# EAGLE board InkTime (EAGLE 9.7.0)
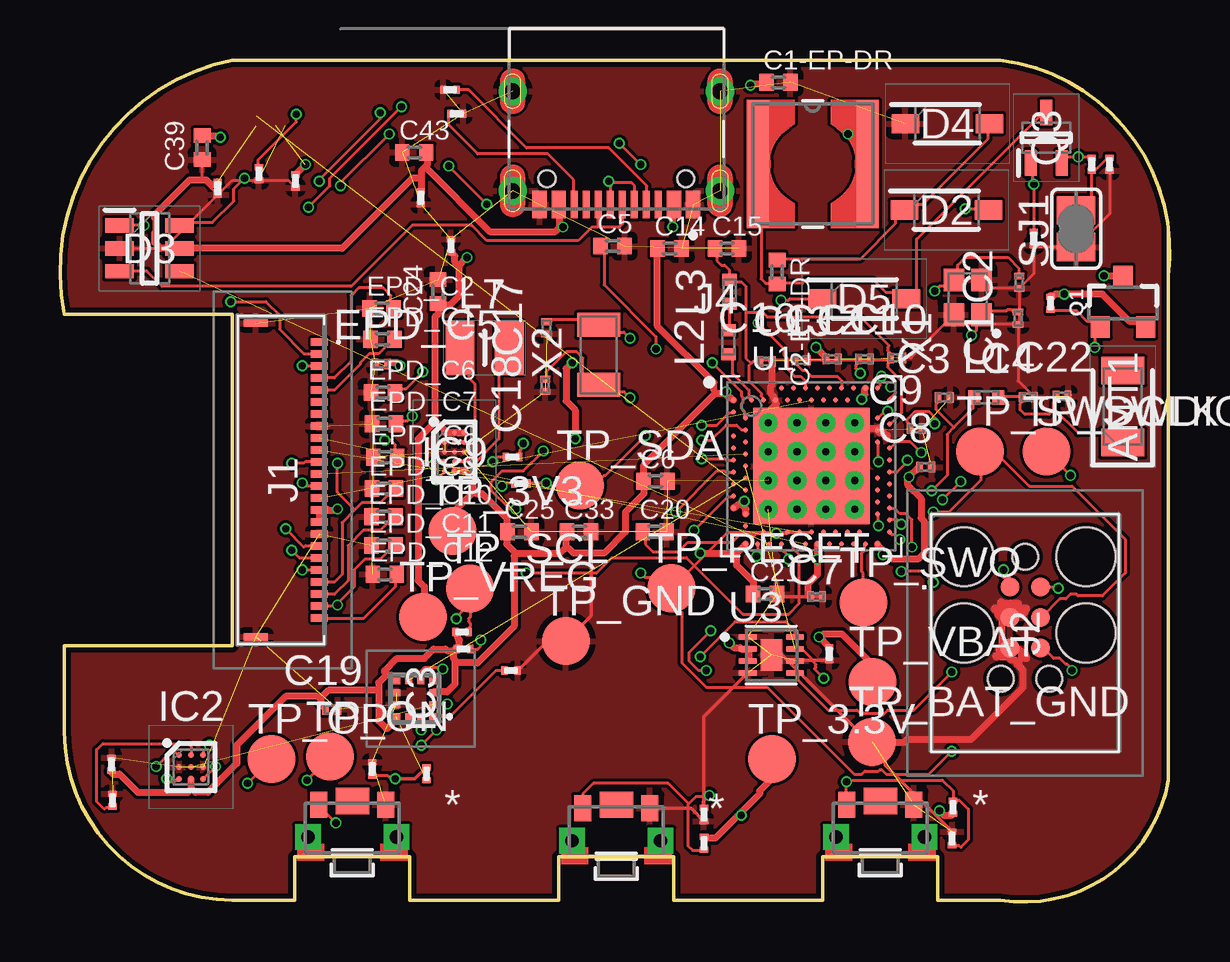
[diagram p2: board, top side]
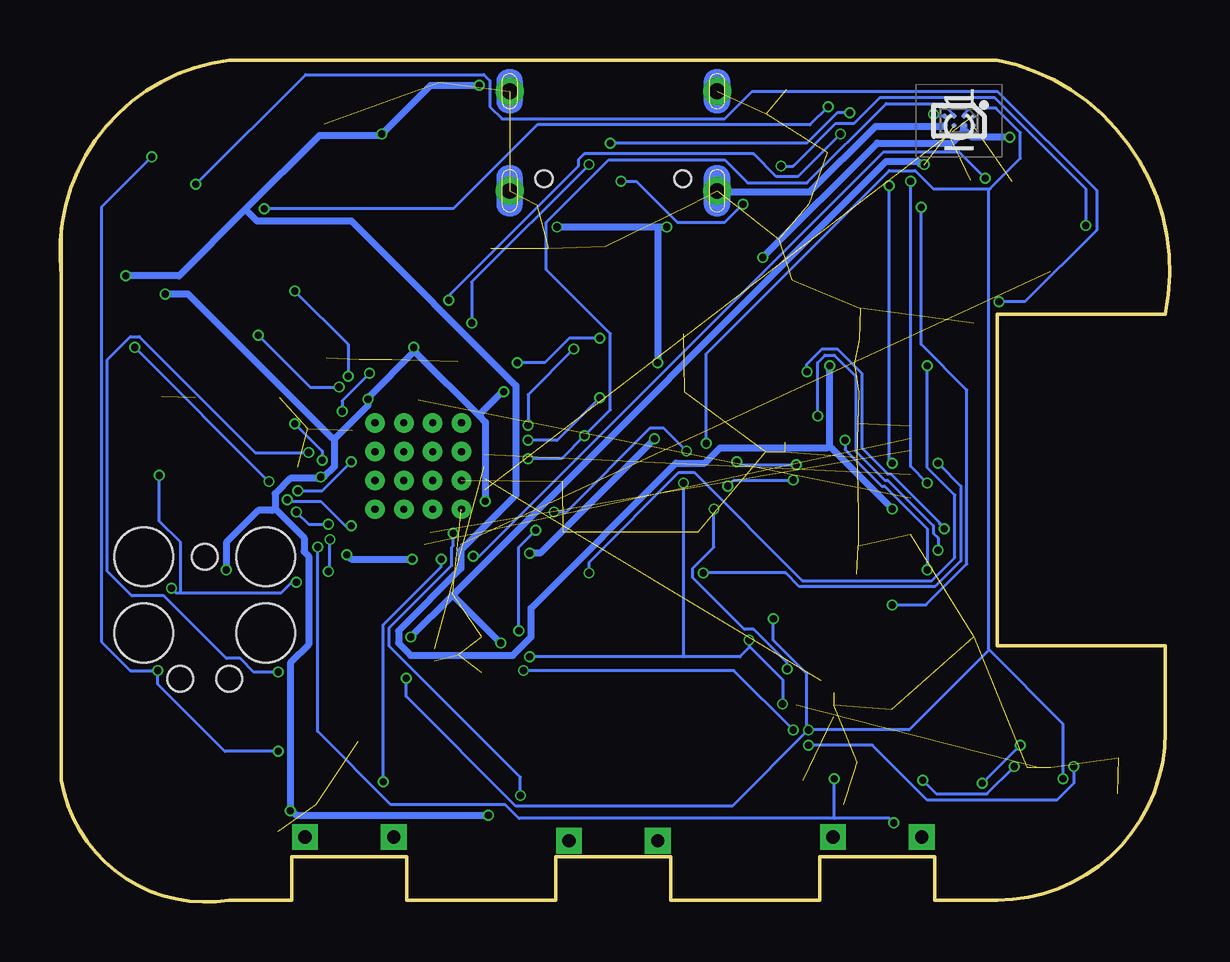
[diagram p3: board, bottom side, seen from below]

Size 46.24 x 35.08 mm. Coordinates in mm from the lower left corner, seen from the top.
Outline: 46.18,26.08 46.18,5.08 arc-90 39.18,0.08 36.58,0.08 36.58,1.88 31.78,1.88 31.78,0.08 25.58,0.08 25.58,1.88 20.78,1.88 20.78,0.08 14.58,0.08 14.58,1.88 9.78,1.88 9.78,0.08 7.18,0.08 arc-90 0.18,7.08 0.18,10.68 7.18,10.68 7.18,24.48 0.18,24.48 arc-90 7.18,35.08 39.18,35.08 arc-90 46.18,26.08
Outline: 46.18,26.08 46.18,28.08
Copper layers (1+2*15+16): Top 0.035mm / dielectric 1.6mm / Route2 0.035mm / dielectric 0.15mm / Route15 0.035mm / dielectric 0.2mm / Bottom 0.035mm
Design rules "jlcpcb-2layers.dru *": minimum track width 5mil, minimum drill 0.3mm, track to track 5mil, track to pad 5mil, pad to pad 5mil, via to via 5mil, smd to smd 5mil, copper to edge 0.2mm, drill to drill 6mil, minimum pad ring 10mil, minimum via ring 3mil, stop-mask expansion 4mil, vias tented up to drill 0mil, thermal gap 10mil
Net classes: 1 Power: width 0.3 mm

## Footprints (pad centres in the part's own frame; a part is rotated, then mirrored left to right if it is on the bottom)
2450AT18B100E_ANTC3216X140N = smd 1.15 x 1.8: 1 -1.5,0; 2 1.5,0
NORDIC_NRF_3_RESC0201_L = smd 0.28 x 0.43: 1 -0.255,0; 2 0.255,0
PERFECT_0402_0402 = smd 0.6 x 0.7: 1 -0.5,0; 2 0.5,0
GRM011R60J152KE01L_1_0201 = smd 0.35 x 0.25: 1 0,0.275; 2 0,-0.275
ESP32_C6_LIBRARY_5_SOD3716X135N = smd 1.15 x 0.8: 1 -1.75,0; 2 1.75,0
ESP32_C6_LIBRARY_3_SOT95P280X145-6N = smd 1.2 x 0.6: 1 -1.25,0.95; 2 -1.25,0; 3 -1.25,-0.95; 4 1.25,-0.95; 5 1.25,0; 6 1.25,0.95
BQ25180YBGR_BGA8C40P2X4_100X155X50 = smd 0.2 x 0.2: A1 -0.2,0.6; A2 0.2,0.6; B1 -0.2,0.2; B2 0.2,0.2; C1 -0.2,-0.2; C2 0.2,-0.2; D1 -0.2,-0.6; D2 0.2,-0.6
DRV2605YZFR_BGA9C50P3X3_144X144X62 = smd 0.25 x 0.25: A1 -0.5,0.5; A2 0,0.5; A3 0.5,0.5; B1 -0.5,0; B2 0,0; B3 0.5,0; C1 -0.5,-0.5; C2 0,-0.5; C3 0.5,-0.5
BMA423_BMA423 = smd 0.3 x 0.35: 1 -0.75,-0.775; 2 -0.25,-0.775; 3 0.25,-0.775; 4 0.75,-0.775; 7 0.75,0.775; 8 0.25,0.775; 9 -0.25,0.775; 10 -0.75,0.775 | smd 0.35 x 0.3: 5 0.775,-0.25; 6 0.775,0.25; 11 -0.775,0.25; 12 -0.775,-0.25
RT6160AWSC_BGA15C40P3X5_140X230X60 = smd 0.216 x 0.216: A1 -0.4,0.8; A2 0,0.8; A3 0.4,0.8; B1 -0.4,0.4; B2 0,0.4; B3 0.4,0.4; C1 -0.4,0; C2 0,0; C3 0.4,0; D1 -0.4,-0.4; D2 0,-0.4; D3 0.4,-0.4; E1 -0.4,-0.8; E2 0,-0.8; E3 0.4,-0.8
503480-2400_5034802400 = smd 0.3 x 0.7: 1 -5.75,1.525; 2 -5.25,1.525; 3 -4.75,1.525; 4 -4.25,1.525; 5 -3.75,1.525; 6 -3.25,1.525; 7 -2.75,1.525; 8 -2.25,1.525; 9 -1.75,1.525; 10 -1.25,1.525; 11 -0.75,1.525; 12 -0.25,1.525; 13 0.25,1.525; 14 0.75,1.525; 15 1.25,1.525; 16 1.75,1.525; 17 2.25,1.525; 18 2.75,1.525; 19 3.25,1.525; 20 3.75,1.525; 21 4.25,1.525; 22 4.75,1.525; 23 5.25,1.525; 24 5.75,1.525 | smd 0.3 x 1: MP1 -6.54,-1.125; MP2 6.54,-1.125
TC2030-IDC_TC2030IDC = smd 0.783 x 0.783: 1 -0.953,-0.635; 2 -0.953,0.635; 3 0.317,-0.635; 4 0.317,0.635; 5 1.588,-0.635; 6 1.588,0.635 | hole 2.451: -2.223,-2.54; -2.223,2.54; 0.952,-2.54; 0.952,2.54 | hole 1.067: -2.223,0; 2.857,-1.016; 2.857,1.016
KH-TYPE-C-16P_KINGHELM_KH-TYPE-C-16P = smd 0.6 x 1.15: A1_B12 -3.2,4.725; A4_B9 -2.4,4.725; A9_B4 2.4,4.725; A12_B1 3.2,4.725 | smd 0.3 x 1.15: A5 -1.25,4.725; A6 -0.25,4.725; A7 0.25,4.725; A8 1.25,4.725; B5 1.75,4.725; B6 0.75,4.725; B7 -0.75,4.725; B8 -1.75,4.725 | drill 0.65 pad 1.05: SH1 -4.32,0; SH2 4.32,0; SH3 -4.32,4.15; SH4 4.32,4.15 | hole 0.7: -2.89,3.65; 2.89,3.65
NORDIC_NRF_2_RESC0402_L = smd 0.5 x 0.6: 1 -0.5,0; 2 0.5,0
ESP32_C6_LIBRARY_2_IND_4828-WE-TPC_WRE = smd 0.9 x 5.3: 1 -2.286,0; 2 2.286,0
MLP2016SR47MT0S1_INDC2016X100N = smd 1.2 x 2.2: 1 -1.028,0; 2 1.028,0
ESP32_C6_LIBRARY_4_ESP32_C6_LIBRARY_4_ESP32_C6_LIBRARY_4_ESP32_C6_LIBRARY_4_ESP32_WROVER_SPARKFUN-DISCRETESEMI_SOT23-3 = smd 0.8 x 0.9: 1 -0.95,-1; 2 0.95,-1; 3 0,1.1
ESP32_C6_LIBRARY_6_SOT65P210X110-3N = smd 1.05 x 0.5: 1 -1.05,0.65; 2 -1.05,-0.65; 3 1.05,0
ERA-1AEB3401C_0201 = smd 0.35 x 0.25: 1 0,0.275; 2 0,-0.275
ESP32_C6_LIBRARY_7_JUMPER_SJ = smd 1.168 x 1.6: 1 -0.762,0; 2 0.762,0
2025-10-22_07-23-44_LIBRARY_SW_EVP-AKE31A_PAN = smd 0.711 x 1.092: 1 -1.4,-0.972; 2 1.4,-0.972 | drill 0.559 pad 0.914 square: 3 -1.848,0.381; 4 1.848,0.381 | smd 1.397 x 1.092: 5 0,-1.124
HECTOR_WATCH_1_TP20R = smd 2 x 2: TP 0,0
NORDIC_NRF_4_AQFN50P700X700X85_HS-74N = smd 4.85 x 4.85: P$74 0,0 | drill 0.3 pad 0.6: P$75 -1.8,1.8; P$76 -0.6,1.8; P$77 0.6,1.8; P$78 1.8,1.8; P$79 -1.8,0.6; P$80 -0.6,0.6; P$81 0.6,0.6; P$82 1.8,0.6; P$83 -1.8,-0.6; P$84 -0.6,-0.6; P$85 0.6,-0.6; P$86 1.8,-0.6; P$87 -1.8,-1.8; P$88 -0.6,-1.8; P$89 0.6,-1.8; P$90 1.8,-1.8 | smd 0.2 x 0.2: P$A8 -1.25,3.25; P$A10 -0.75,3.25; P$A12 -0.25,3.25; P$A14 0.25,3.25; P$A16 0.75,3.25; P$A18 1.25,3.25; P$A20 1.75,3.25; P$A22 2.25,3.25; P$A23 2.75,3.25; P$AA24 3.25,-2.25; P$AB2 -2.75,-2.5; P$AC5 -2,-2.75; P$AC9 -1,-2.75; P$AC11 -0.5,-2.75; P$AC13 0,-2.75; P$AC15 0.5,-2.75; P$AC17 1,-2.75; P$AC19 1.5,-2.75; P$AC21 2,-2.75; P$AC24 3.25,-2.75; P$AD2 -2.75,-3.25; P$AD4 -2.25,-3.25; P$AD6 -1.75,-3.25; P$AD8 -1.25,-3.25; P$AD10 -0.75,-3.25; P$AD12 -0.25,-3.25; P$AD14 0.25,-3.25; P$AD16 0.75,-3.25; P$AD18 1.25,-3.25; P$AD20 1.75,-3.25; P$AD22 2.25,-3.25; P$AD23 2.75,-3.25; P$B1 -3.25,2.75; P$B3 -2.5,2.75; P$B5 -2,2.75; P$B7 -1.5,2.75; P$B9 -1,2.75; P$B11 -0.5,2.75; P$B13 0,2.75; P$B15 0.5,2.75; P$B17 1,2.75; P$B19 1.5,2.75; P$B24 3.25,2.75; P$C1 -3.25,2.25; P$D2 -2.75,2; P$D23 2.75,2; P$E24 3.25,1.75; P$F2 -2.75,1.5; P$F23 2.75,1.5; P$G1 -3.25,1.25; P$H2 -2.75,1; P$H23 2.75,1; P$J1 -3.25,0.75; P$J24 3.25,0.75; P$K2 -2.75,0.5; P$L1 -3.25,0.25; P$L24 3.25,0.25; P$M2 -2.75,0; P$N1 -3.25,-0.25; P$N24 3.25,-0.25; P$P2 -2.75,-0.5; P$P23 2.75,-0.5; P$R1 -3.25,-0.75; P$R24 3.25,-0.75; P$T2 -2.75,-1; P$T23 2.75,-1; P$U1 -3.25,-1.25; P$U24 3.25,-1.25; P$V23 2.75,-1.5; P$W1 -3.25,-1.75; P$W24 3.25,-1.75; P$Y2 -2.75,-2; P$Y23 2.75,-2
ESP32_C6_LIBRARY_SON50P200X200X80-9N = smd 0.76 x 0.27: 1 -0.985,0.75; 2 -0.985,0.25; 3 -0.985,-0.25; 4 -0.985,-0.75; 5 0.985,-0.75; 6 0.985,-0.25; 7 0.985,0.25; 8 0.985,0.75 | smd 0.9 x 1.3: 9 0,0
NORDIC_NRF_BT-XTAL_2016_N = smd 0.95 x 0.85: 1 -0.725,-0.575; 2 0.725,-0.575; 3 0.725,0.575; 4 -0.725,0.575
NORDIC_NRF_1_XTAL_3215_N = smd 1 x 1.8: 1 -1.25,0; 2 1.25,0

## Placement (x,y rotation side)
ANT1  2450AT18B100E  [2450AT18B100E_ANTC3216X140N]  44.28,20.64 90 top
C1  12pF  [NORDIC_NRF_3_RESC0201_L]  39.92,24.32 90 top
C1-EP-DR  10uF  [PERFECT_0402_0402]  29.93,34.15 0 top
C2  12pF  [NORDIC_NRF_3_RESC0201_L]  39.97,25.82 90 top
C2-EP-DR  4.7uF/25V  [PERFECT_0402_0402]  29.88,26.25 270 top
C3  1pF  [NORDIC_NRF_3_RESC0201_L]  36.84,21.02 0 top
C4  1pF  [NORDIC_NRF_3_RESC0201_L]  40.35,21.03 0 top
C5  100nF  [PERFECT_0402_0402]  23.02,27.33 0 top
C6  4.7uF  [PERFECT_0402_0402]  24.81,17.53 0 top
C7  100nF  [NORDIC_NRF_3_RESC0201_L]  31.52,12.72 0 top
C8  100nF  [NORDIC_NRF_3_RESC0201_L]  36.07,18.12 0 top
C9  820pF  [NORDIC_NRF_3_RESC0201_L]  35.67,19.72 0 top
C10  N.C.  [NORDIC_NRF_3_RESC0201_L]  34.86,22.67 0 top
C11  100pF  [NORDIC_NRF_3_RESC0201_L]  33.52,22.62 0 top
C12  100nF  [NORDIC_NRF_3_RESC0201_L]  32.17,22.62 0 top
C13  N.C.  [NORDIC_NRF_3_RESC0201_L]  30.88,22.57 0 top
C14  4.7uF  [PERFECT_0402_0402]  25.4,27.23 0 top
C15  1.0uF  [PERFECT_0402_0402]  27.79,27.23 0 top
C16  47nF  [NORDIC_NRF_3_RESC0201_L]  29.42,22.52 0 top
C17  12pF  [NORDIC_NRF_3_RESC0201_L]  20.27,23.92 90 top
C18  12pF  [NORDIC_NRF_3_RESC0201_L]  20.22,21.52 90 top
C19  100nF  [NORDIC_NRF_3_RESC0201_L]  11.32,8.02 0 top
C20  4.7uF  [PERFECT_0402_0402]  24.78,15.43 0 top
C21  4.7uF  [PERFECT_0402_0402]  29.37,12.83 0 top
C22  N.C.  [NORDIC_NRF_3_RESC0201_L]  41.75,21.08 0 top
C23  0.1uF  [GRM011R60J152KE01L_1_0201]  16.29,27.34 0 top
C24  10uF  [PERFECT_0402_0402]  15.75,25.43 270 top
C25  22uF  [PERFECT_0402_0402]  19.14,15.43 0 top
C27  0.1uF  [GRM011R60J152KE01L_1_0201]  32.05,10.34 180 top
C29  1uF  [GRM011R60J152KE01L_1_0201]  13.01,5.54 0 top
C30  1uF  [GRM011R60J152KE01L_1_0201]  37.17,2.64 0 top
C31  1uF  [GRM011R60J152KE01L_1_0201]  26.83,3.64 180 top
C32  1uF  [GRM011R60J152KE01L_1_0201]  2.19,4.24 0 top
C33  22uF  [PERFECT_0402_0402]  21.63,15.43 0 top
C34  0.1uF  [GRM011R60J152KE01L_1_0201]  2.15,5.74 0 top
C37  1uF  [GRM011R60J152KE01L_1_0201]  9.81,30.04 180 top
C38  1uF  [GRM011R60J152KE01L_1_0201]  6.57,29.74 180 top
C39  10uF  [PERFECT_0402_0402]  5.92,31.43 270 top
C42  0.1uF  [GRM011R60J152KE01L_1_0201]  15.03,29.34 0 top
C43  4.7uF  [PERFECT_0402_0402]  14.76,31.23 0 top
D2  MBR0530  [ESP32_C6_LIBRARY_5_SOD3716X135N]  36.93,28.83 0 top
D3  USBLC6-2SC6Y  [ESP32_C6_LIBRARY_3_SOT95P280X145-6N]  3.73,27.23 0 top
D4  MBR0530  [ESP32_C6_LIBRARY_5_SOD3716X135N]  36.97,32.43 0 top
D5  MBR0530  [ESP32_C6_LIBRARY_5_SOD3716X135N]  33.51,25.13 0 top
EPD_C1  1uF/50V  [PERFECT_0402_0402]  13.43,23.45 0 top
EPD_C2  1uF/50V  [PERFECT_0402_0402]  13.4,24.73 0 top
EPD_C5  0.1uF/50V  [NORDIC_NRF_3_RESC0201_L]  13.39,22.42 0 top
EPD_C6  1uF/50V  [PERFECT_0402_0402]  13.45,21.23 0 top
EPD_C7  1uF/50V  [PERFECT_0402_0402]  13.5,19.93 0 top
EPD_C8  1uF/50V  [PERFECT_0402_0402]  13.55,18.53 0 top
EPD_C9  1uF/50V  [PERFECT_0402_0402]  13.5,17.23 0 top
EPD_C10  1uF/50V  [PERFECT_0402_0402]  13.48,16.05 0 top
EPD_C11  1uF/50V  [PERFECT_0402_0402]  13.48,14.85 0 top
EPD_C12  1uF/50V  [PERFECT_0402_0402]  13.53,13.65 0 top
IC1  BQ25180YBGR  [BQ25180YBGR_BGA8C40P2X4_100X155X50]  8.78,32.55 270 bottom
IC2  DRV2605YZFR  [DRV2605YZFR_BGA9C50P3X3_144X144X62]  5.46,5.62 0 top
IC3  BMA421  [BMA423_BMA423]  14.78,8.47 90 top
IC9  RT6160AWSC  [RT6160AWSC_BGA15C40P3X5_140X230X60]  16.43,18.75 0 top
J1  503480-2400  [503480-2400_5034802400]  9.28,17.58 270 top
J2  TC2030-IDC  [TC2030-IDC_TC2030IDC]  40.21,12.16 270 top
J4  KH-TYPE-C-16P  [KH-TYPE-C-16P_KINGHELM_KH-TYPE-C-16P]  23.18,33.78 180 top
L1  3.9nH  [NORDIC_NRF_2_RESC0402_L]  38.6,21.02 0 top
L2  10uH  [NORDIC_NRF_2_RESC0402_L]  27.85,23.32 90 top
L3  15nH  [NORDIC_NRF_2_RESC0402_L]  27.9,25.42 90 top
L5  68uH  [ESP32_C6_LIBRARY_2_IND_4828-WE-TPC_WRE]  31.36,30.75 0 top
L7  FTC252012SR47MBCA  [MLP2016SR47MT0S1_INDC2016X100N]  17.69,23.09 0 top
Q1  20V/4.2A/52mΩ/1.4W  [ESP32_C6_LIBRARY_4_ESP32_C6_LIBRARY_4_ESP32_C6_LIBRARY_4_ESP32_C6_LIBRARY_4_ESP32_WROVER_SPARKFUN-DISCRETESEMI_SOT23-3]  44.29,24.96 0 top
Q3  SI1308EDL-T1-GE3  [ESP32_C6_LIBRARY_6_SOT65P210X110-3N]  41.09,31.84 90 top
R1_EP_DR  0.47  [ERA-1AEB3401C_0201]  42.99,30.74 180 top
R1_USB  5K1  [ERA-1AEB3401C_0201]  16.25,33.84 90 top
R2  0  [ERA-1AEB3401C_0201]  19.21,17.44 270 top
R2_EP_DR  10K  [ERA-1AEB3401C_0201]  40.57,27.64 180 top
R2_USB  5K1  [ERA-1AEB3401C_0201]  16.53,32.84 90 top
R3  0  [ERA-1AEB3401C_0201]  18.79,9.64 270 top
R4  0  [ERA-1AEB3401C_0201]  18.85,18.54 270 top
R5  10K  [ERA-1AEB3401C_0201]  37.21,3.94 0 top
R7  10K  [ERA-1AEB3401C_0201]  15.27,5.34 0 top
R8  10K  [ERA-1AEB3401C_0201]  26.83,2.44 180 top
R9  10K  [ERA-1AEB3401C_0201]  8.29,30.34 180 top
R17  3K3  [ERA-1AEB3401C_0201]  16.75,11.24 90 top
R18  3K3  [ERA-1AEB3401C_0201]  16.81,10.54 90 top
R_PWR_EPD  10K  [ERA-1AEB3401C_0201]  41.27,24.94 180 top
R_TYPE_SEL  2.2  [ERA-1AEB3401C_0201]  43.73,30.74 180 top
SJ1  [ESP32_C6_LIBRARY_7_JUMPER_SJ]  42.34,28.05 90 top
SW_DN  2025-10-22_07-23-44_LIBRARY_EVP-AKE31ASW_EVP-AKE31A_PAN  [2025-10-22_07-23-44_LIBRARY_SW_EVP-AKE31A_PAN]  12.18,3.08 180 top
SW_ENT  2025-10-22_07-23-44_LIBRARY_EVP-AKE31ASW_EVP-AKE31A_PAN  [2025-10-22_07-23-44_LIBRARY_SW_EVP-AKE31A_PAN]  23.18,2.93 180 top
SW_UP  2025-10-22_07-23-44_LIBRARY_EVP-AKE31ASW_EVP-AKE31A_PAN  [2025-10-22_07-23-44_LIBRARY_SW_EVP-AKE31A_PAN]  34.18,3.08 180 top
TP_3.3V  HECTOR_WATCH_1_TPTP20R  [HECTOR_WATCH_1_TP20R]  29.66,5.95 0 top
TP_3V3  HECTOR_WATCH_1_TPTP20R  [HECTOR_WATCH_1_TP20R]  16.36,15.45 0 top
TP_BAT_GND  HECTOR_WATCH_1_TPTP20R  [HECTOR_WATCH_1_TP20R]  33.84,6.67 0 top
TP_GND  HECTOR_WATCH_1_TPTP20R  [HECTOR_WATCH_1_TP20R]  21.08,10.87 0 top
TP_ON  HECTOR_WATCH_1_TPTP20R  [HECTOR_WATCH_1_TP20R]  11.24,6.05 0 top
TP_OP  HECTOR_WATCH_1_TPTP20R  [HECTOR_WATCH_1_TP20R]  8.82,5.95 0 top
TP_RESET  HECTOR_WATCH_1_TPTP20R  [HECTOR_WATCH_1_TP20R]  25.48,13.07 0 top
TP_SCL  HECTOR_WATCH_1_TPTP20R  [HECTOR_WATCH_1_TP20R]  17.08,13.05 0 top
TP_SDA  HECTOR_WATCH_1_TPTP20R  [HECTOR_WATCH_1_TP20R]  21.67,17.35 0 top
TP_SWDCLK  HECTOR_WATCH_1_TPTP20R  [HECTOR_WATCH_1_TP20R]  38.34,18.77 0 top
TP_SWDIO  HECTOR_WATCH_1_TPTP20R  [HECTOR_WATCH_1_TP20R]  41.11,18.77 0 top
TP_SWO  HECTOR_WATCH_1_TPTP20R  [HECTOR_WATCH_1_TP20R]  33.47,12.47 0 top
TP_VBAT  HECTOR_WATCH_1_TPTP20R  [HECTOR_WATCH_1_TP20R]  33.86,9.17 0 top
TP_VREG  HECTOR_WATCH_1_TPTP20R  [HECTOR_WATCH_1_TP20R]  15.12,11.87 0 top
U1  NRF52840_QF  [NORDIC_NRF_4_AQFN50P700X700X85_HS-74N]  31.31,18.16 0 top
U3  MAX17048G+T10  [ESP32_C6_LIBRARY_SON50P200X200X80-9N]  29.64,10.29 0 top
X1  32MHz  [NORDIC_NRF_BT-XTAL_2016_N]  37.82,25.19 90 top
X2  32.768kHZ  [NORDIC_NRF_1_XTAL_3215_N]  22.45,22.79 270 top

## Tracks (layer width: path | path; a pad name or v marks a point on that pad's centre or on a via)
3V3  (via drill 0.3)  (1 unrouted)
  Top 0.3: 28.32,3.68 29.15,4.5 29.15,4.63 29.66,5.14 29.66,5.9 TP_3.3V.TP | 28.32,3.68 27.31,2.66 26.86,2.66 R8.2 | R_PWR_EPD.2 41.28,25.27 41.4,25.27 41.47,25.33 v41.85,25.33 43.44,25.33 44.58,24.19 45.02,24.19 45.22,23.99 Q1.2 | U1.P$AD14 31.56,14.85 v31.56,14.28 31.56,13.64 31.18,13.26 31.18,12.76 31.25,12.69 C7.1 | 28.39,16.57 28.26,16.57 28.13,16.44 28.07,16.44 U1.P$W1 | 28.39,16.57 28.58,16.38 28.58,16.18 U1.P$Y2 | 34.39,14.57 34.67,14.28 35.75,14.28 36.01,14.53 36.01,15.87 35.88,15.99 35.88,16.82 35.31,17.39 35.31,17.65 v35.37,17.71 35.75,18.09 C8.1 | 34.39,14.57 34.1,14.85 U1.P$AD23 | v33.4,20.95 33.4,21.01 33.53,21.14 33.53,21.39 U1.P$A22 | v36.64,3.8 36.83,3.61 37.15,3.61 R5.2 | v31.5,23.11 31.88,22.73 31.88,22.66 C12.1 | v28.51,16.69 28.51,16.63 28.39,16.57 | v39.31,13.83 39.31,13.64 39.56,13.39 39.56,13.14 J2.1 | v34.29,14.47 34.39,14.57 | v28.39,3.61 28.32,3.68 | 5.46,4.69 5.46,5.07 IC2.C2 | 5.46,4.69 5.34,4.56 3.24,4.56 2.48,5.33 2.23,5.33 2.1,5.45 C34.2 | 16.45,9.96 16.45,10.09 16.39,10.15 16.39,10.47 | 16.45,9.96 16.45,9.07 16.13,8.76 15.56,8.76 IC3.3 | 16.39,10.47 16.51,10.6 R18.1 16.64,10.66 16.64,10.91 16.58,10.98 16.58,11.17 16.51,11.23 R17.1 | 13.27,8.82 13.27,9.14 13.59,9.45 | 13.27,8.82 13.27,7.55 13.59,7.23 13.66,7.23 14.04,7.61 14.04,7.68 IC3.10 | 13.59,9.45 13.78,9.45 13.97,9.26 IC3.7 | 10.86,8.5 10.86,8.25 11.05,8.06 C19.1 | 10.86,8.5 11.18,8.82 13.27,8.82 | 16.39,10.47 16.13,10.47 16.07,10.53 15.56,10.53 15.18,10.15 14.04,10.15 13.53,9.64 13.53,9.58 13.59,9.45 | 5.46,4.69 5.59,4.63 5.65,4.56 6.16,4.56 7.37,5.77 7.37,6.53 9.4,8.56 10.73,8.56 10.86,8.5
  Top 0.3: 16.83,17.96 16.45,17.96 IC9.E2 | 16.83,17.96 IC9.E3 | 17.21,17.07 17.21,17.65 16.96,17.9 16.83,17.96 | 17.21,17.07 16.39,16.25 16.39,15.49 TP_3V3.TP | 17.21,17.07 17.34,17.01 17.59,17.01 18.61,15.99 18.61,15.49 C25.1 18.61,15.3 18.61,14.91 18.99,14.53 | 21.09,14.79 21.09,15.42 C33.1 | 21.09,14.79 20.83,14.53 18.99,14.53 | 27.69,21.2 27.88,21.01 27.94,21.01 28.01,20.95 U1.P$B1 | 27.31,21.2 27.69,21.2 | 27.31,21.2 24.32,18.22 24.32,17.58 C6.1 24.39,17.45 24.39,17.39 24.32,17.33 24.32,17.01 23.56,16.25 23.56,15.42 22.67,14.53 21.4,14.53 21.21,14.72 21.09,14.79 | C14.1 24.89,27.17 24.89,23.99 27.24,21.65 27.24,21.33 27.31,21.2 | 16.45,9.96 17.4,9.96 18.93,11.49 18.93,14.41 18.99,14.53 | v27.75,21.26 27.69,21.2
  Bottom 0.3: 34.8,19.3 33.4,20.69 v33.4,20.95 33.34,21.07 31.5,22.92 | 34.8,19.3 34.8,18.15 35.25,17.71 v35.37,17.71 35.5,17.65 36.64,17.65 37.28,17.01 37.28,16.38 | 37.28,16.38 36.07,15.17 36.07,14.6 35.88,14.41 35.88,10.72 36.64,9.96 v36.64,3.8 36.52,3.74 36.39,3.61 v28.39,3.61 | 31.5,22.92 v31.5,23.11 | v28.51,16.69 28.51,19.99 28.8,20.28 | 28.8,20.28 31.37,22.85 31.5,22.92 | v39.31,13.83 39.31,14.98 37.98,16.31 37.4,16.31 37.28,16.38 | v31.56,14.28 34.1,14.28 v34.29,14.47 | v41.85,25.33 40.9,25.33 34.93,19.36 34.8,19.3 | 28.8,20.28 27.82,21.26 v27.75,21.26
ALERT  (via drill 0.3)
  Top 0.127: v35.88,18.72 35.44,19.17 34.86,19.17 34.61,18.91 U1.P$J24 | v37.15,9.58 35.56,7.99 34.48,7.99 34.29,7.8 34.23,7.8 34.17,7.87 33.47,7.87 33.4,7.8 33.21,7.99 32.01,7.99 30.74,9.26 30.74,9.52 30.67,9.58 U3.5
  Bottom 0.127: v35.88,18.72 38.1,18.72 42.93,23.55 43.31,23.55 44.26,22.6 44.26,13.77 43.25,12.76 41.91,12.76 39.31,10.15 38.74,10.15 38.17,9.58 v37.15,9.58
D+  (1 unrouted)
D-  (via drill 0.3)
  Top 0.127: v29.02,14.41 29.09,14.41 29.21,14.53 29.09,14.66 29.09,14.85 U1.P$AD4 | v7.69,30.15 7.24,29.71 7.24,29.2 6.35,28.31 5.15,28.31 5.02,28.19 D3.6
  Bottom 0.127: v29.02,14.41 28.77,14.41 11.94,31.23 8.77,31.23 v7.69,30.15
DEC1  (via drill 0.3)
  Top 0.127: v26.74,19.87 27.37,19.87 27.88,20.38 28.01,20.38 U1.P$C1 | v24.83,23.04 24.83,23.55 22.67,25.71 22.67,27.17 22.55,27.3 C5.1
  Bottom 0.127: v26.74,19.87 26.74,21.14 v24.83,23.04
DEC3  (via drill 0.3)
  Top 0.127: v34.48,20.44 34.36,20.44 34.1,20.18 U1.P$D23 | v33.34,22.03 33.15,22.22 33.15,22.34 33.21,22.41 33.21,22.6 C11.1
  Bottom 0.127: v34.48,20.44 34.48,20.88 v33.34,22.03
DEC4_6
  Top 0.127: U1.P$E24 34.61,19.93 35.05,20.38 35.05,21.71 34.48,22.28 34.48,22.41 34.55,22.47 34.55,22.66 C10.1 | 28.8,22.44 28.9,22.53 29.09,22.53 29.15,22.6 29.21,22.53 | 28.8,22.44 28.7,22.34 28.7,21.71 29.21,21.2 29.21,21.07 29.28,21.01 29.28,20.95 U1.P$B5 | 29.21,22.53 C16.1 | C15.1 27.31,27.17 27.37,27.11 27.37,26.73 27.56,26.54 27.69,26.54 27.88,26.34 27.88,25.96 L3.2 27.94,25.9 28.01,25.84 28.39,25.84 28.58,25.65 28.58,24.57 | 28.8,22.44 28.58,22.66 28.58,24.57 | 28.58,24.57 29.28,24.57 29.47,24.38 33.34,24.38 34.55,23.17 34.48,23.11 34.48,22.98 34.55,22.92 34.55,22.73 C10.1 | C10.1 34.52,22.58 29.26,22.58 29.21,22.53
DN  (via drill 0.3)
  Top 0.127: 22.96,29.93 22.99,29.96 23.82,29.96 23.94,29.84 23.94,29.07 J4.B7 | 22.96,29.93 22.93,29.9 22.93,29.07 J4.A7 | v3.5,28.19 2.54,28.19 D3.1 | v17.78,29.07 v16.2,30.66 | 22.96,29.93 v22.86,30.03
  Bottom 0.127: v3.5,28.19 3.5,29.71 7.31,33.52 12.07,33.52 13.15,32.44 13.91,32.44 15.69,30.66 v16.2,30.66 | v17.78,29.07 18.54,28.31 20.51,28.31 22.23,30.03 v22.86,30.03
DP
  Top 0.127: 22.45,28.15 22.48,28.12 23.31,28.12 23.43,28.25 23.43,29.01 J4.A6 | 22.45,28.15 22.42,28.19 22.42,29.01 J4.B6 | D3.3 2.54,26.28 3.62,26.28 4.26,25.65 12.13,25.65 14.67,28.19 17.15,28.19 17.78,27.55 21.59,27.55 22.16,28.12 22.42,28.12 22.45,28.15
EPD_3V1
  Top 0.127: C2-EP-DR.1 29.91,26.79 33.34,26.79 34.8,28.25 34.8,28.5 35.12,28.82 D2.1 35.25,28.82 35.5,29.07 35.94,29.07 38.67,31.81 38.67,32.38 D4.2
EPD_3V3  (via drill 0.3)
  Top 0.3: v14.16,22.34 14.04,22.47 13.66,22.47 EPD_C5.2 | v11.56,16.38 11.5,16.31 11.18,16.31 11.12,16.38 11.05,16.31 10.86,16.31 J1.15 10.8,16.18 10.8,15.87 J1.16 | v28.77,34.03 28.83,34.09 29.4,34.09 C1-EP-DR.1 | v32.83,32 33.59,31.23 33.59,30.79 L5.2 | v43.5,26.09 44.26,26.09 Q1.3
  Bottom 0.3: 14.16,18.98 v14.16,22.34 | v11.56,16.38 14.16,18.98 | v28.77,34.03 30.8,34.03 v32.83,32 32.96,31.93 35.44,31.93 38.52,28.85 | v43.5,26.09 41.28,26.09 38.52,28.85 | 38.52,28.85 38.04,28.38 34.1,28.38 27.24,21.52 27.24,16.95 29.53,14.66 29.53,13.9 32.13,11.29 32.13,10.79 31.63,10.28 27.37,10.28 26.61,11.04 26.61,12.25 20.58,18.28 19.37,18.28 18.74,18.91 14.29,18.91 14.16,18.98
EPD_BUSY  (1 unrouted)
EPD_CS  (1 unrouted)
EPD_DC  (via drill 0.3)
  Top 0.127: v19.43,13.71 22.35,13.71 22.99,14.34 26.1,14.34 28.45,11.99 30.36,11.99 30.8,12.44 30.8,14.47 30.55,14.72 30.55,14.85 U1.P$AD10 | v9.66,18.28 10.16,18.28 10.23,18.34 10.8,18.34 J1.11
  Bottom 0.127: v19.43,13.71 16,13.71 15.43,13.14 9.78,13.14 8.7,14.22 8.7,17.33 v9.66,18.28
EPD_RST  (1 unrouted)
GDR  (via drill 0.3)
  Top 0.127: R2_EP_DR.2 40.58,27.93 v40.58,29.9 40.58,30.03 40.52,30.09 40.52,30.73 40.45,30.79 Q3.1 | v7.11,25.01 8.58,25.01 9.15,24.44 9.15,23.87 10.16,22.85 10.8,22.85 J1.2
  Bottom 0.127: v7.11,25.01 6.04,25.01 3.05,28 3.05,29.65 7.18,33.77 17.4,33.77 18.54,32.63 27.82,32.63 28.32,33.14 28.32,34.22 28.58,34.47 36.01,34.47 v40.58,29.9
GND  (66 unrouted)
  Top 0.127: R_TYPE_SEL.1 43.73,28.68 SJ1.1 40.65,27.29 R2_EP_DR.1 40.57,26.17 C2.1 | C2.1 38.75,25.57 X1.2 | C2.1 39.97,24.12 C1.1 | C1.1 37.65,24.07 X1.4 35.45,22.67 C10.2 | C1.1 39.92,21.71 C4.2 | D3.2 4.34,27.23 C38.1 | C38.1 5.92,30.12 C39.2 | C38.1 7.17,30.07 R9.1 9.51,30.07 C37.1
  Top 0.152: R3.1 20.3,10.87 TP_GND.TP 22.13,11.92 C33.2 | U3.4 26.83,7.72 C31.1 26.29,3.9 SW_ENT.1 | C30.1 34.38,5.71 34.38,5.98 30.3,10.07 | 30.3,10.07 30.07,10.29 U3.9 | C27.1 30.3,10.07 | C7.2 29.98,12.72 C21.2
  Top 0.3: U1.P$88 30.67,16.38 29.66,16.38 U1.P$87 29.53,16.38 29.53,17.52 U1.P$83 29.53,17.58 U1.P$74 | 33.34,19.74 34.1,19.74 34.36,19.49 34.42,19.49 34.48,19.42 34.42,19.36 34.23,19.55 34.17,19.55 34.1,19.61 U1.P$F23 | 33.34,19.74 33.15,19.93 U1.P$78 | U1.P$77 31.94,19.99 32.96,19.99 U1.P$78 | U1.P$84 30.74,17.58 U1.P$74 | U1.P$74 31.37,18.03 31.88,17.52 U1.P$85 | U1.P$79 29.53,18.72 29.53,17.71 U1.P$74 | U1.P$80 30.74,18.72 30.74,18.15 U1.P$74 | 29.66,19.99 30.67,19.99 U1.P$76 | U1.P$89 31.94,16.38 31.94,17.39 U1.P$74 | U1.P$90 33.09,16.38 32.07,16.38 U1.P$74 | U1.P$86 33.15,17.52 33.15,16.5 U1.P$74 | U1.P$81 31.88,18.72 31.37,18.22 U1.P$74 | U1.P$82 33.15,18.79 33.15,19.49 33.28,19.61 U1.P$74 | 33.34,19.74 U1.P$78 | 33.34,19.74 U1.P$74 | 39.94,9.9 39.88,9.9 39.88,9.96 40.07,10.15 40.07,10.34 40.13,10.41 40.2,10.34 40.13,10.28 40.2,10.22 40.26,10.22 40.26,10.15 40.2,10.15 40.13,10.22 40.2,10.28 39.94,10.53 39.63,10.53 J2.5 | 39.94,9.9 39.94,9.96 39.82,10.09 39.63,10.09 39.5,10.22 39.25,10.22 39.18,10.28 38.99,10.28 38.99,10.22 39.18,10.22 39.25,10.28 39.25,10.34 39.12,10.47 39.12,10.53 39.25,10.66 39.25,11.8 39.06,11.99 39.06,12.18 38.99,12.25 38.93,12.25 38.93,12.18 38.99,12.18 39.06,12.25 39.12,12.18 39.12,11.99 39.18,11.99 39.25,12.06 39.25,12.37 39.18,12.44 39.18,12.5 39.25,12.5 39.44,12.31 39.56,12.44 39.63,12.44 39.63,12.37 39.56,12.37 39.5,12.44 39.37,12.44 39.31,12.37 39.31,12.31 39.37,12.31 39.44,12.37 39.56,12.25 39.69,12.37 39.69,12.44 39.94,12.44 39.94,12.37 39.88,12.31 39.75,12.31 39.75,12.37 39.88,12.37 40.07,12.18 40.13,12.18 40.13,12.25 40.26,12.25 40.26,12.18 40.2,12.12 40.2,12.06 40.13,11.99 40.07,11.99 40.07,12.12 39.88,12.12 39.63,11.87 J2.3
  Top 0.3: C16.2 29.66,22.47 29.66,21.52 29.59,21.45 29.59,21.2 29.72,21.07 29.72,21.01 29.78,20.95 U1.P$B7 29.85,20.76 29.53,20.44 29.53,19.99 U1.P$75 29.66,19.99 | 39.94,9.9 40.01,9.77 40.13,9.64 40.13,8.95 37.98,6.79 35.31,6.79 35.18,6.66 33.85,6.66 TP_BAT_GND.TP | 29.66,19.99 U1.P$74
  Bottom 0.3: IC1.D2 9.4,32.31 12.26,32.31 14.99,29.58 18.8,29.58 J4.SH4
  pour Top: -1.64,40.6 -1.64,-3.24 46.9,-3.24 46.92,-3.25 48.9,-5.23 48.9,27.4 48.92,27.42 58.4,36.91 2.07,36.91 2.04,36.92
GND1
  Top 0.127: R_TYPE_SEL.2 43.69,31.04 43.12,30.47 R1_EP_DR.1 42.99,30.41 42.99,29.39 42.36,28.76 SJ1.2
GND2
  Top 0.127: R1_USB.2 16.58,33.84 17.02,33.84 19.43,31.42 22.86,31.42 24.45,29.84 24.45,29.07 J4.A5
HAPTIC_EN  (via drill 0.3)
  Top 0.127: v26.42,15.49 27.82,16.88 28.01,16.88 U1.P$U1 | v27.12,11.29 26.23,10.41 26.23,10.03 26.61,9.64 v26.93,9.64 | v15.05,6.53 v15.69,7.17 | v4,5.64 4.58,6.21 4.83,6.21 4.96,6.09 IC2.A1
  Bottom 0.127: v26.42,15.49 27.12,14.79 v27.12,11.29 | v26.93,9.64 18.16,9.64 v15.69,7.17 | v15.05,6.53 12.39,6.53 10.1,4.25 4.7,4.25 4,4.95 v4,5.64
IMU_INT1  (via drill 0.3)
  Top 0.127: v25.66,16.25 27.37,17.96 27.69,17.96 27.75,17.9 28.01,17.9 U1.P$N1 | v20.13,18.79 19.31,17.96 18.42,17.96 17.97,17.52 17.97,17.14 18.74,16.38 v18.99,16.38 | v15.94,9.71 15.88,9.77 15.18,9.77 15.05,9.64 15.05,9.26 IC3.5
  Bottom 0.127: v25.66,16.25 25.15,16.25 21.66,19.74 21.09,19.74 v20.13,18.79 | v18.99,16.38 18.99,14.79 19.88,13.9 19.88,13.52 17.72,11.36 17.34,11.36 15.94,9.96 v15.94,9.71
IMU_INT2  (1 unrouted)
LX1
  Top 0.127: IC9.B2 16.45,19.17 16.83,19.17 IC9.B3 16.83,19.11 16.96,19.11 17.02,19.04 17.08,19.04 17.28,19.23 17.28,21.58 17.02,21.84 17.02,22.73 16.7,23.04 L7.1
LX2
  Top 0.127: IC9.D2 16.45,18.34 IC9.D3 16.83,18.41 17.02,18.41 17.21,18.22 18.29,19.3 18.29,22.66 18.67,23.04 L7.2
MOSI  (1 unrouted)
N$1  (via drill 0.3)
  Top 0.127: v9.85,32.82 9.85,32.5 8.26,30.92 8.26,30.73 8.19,30.66 8.26,30.6 R9.2
  Bottom 0.127: v9.85,32.82 9.78,32.76 9.4,32.76 IC1.D1
N$2  (via drill 0.3)
  Top 0.127: v15.56,18.22 15.62,18.22 15.81,18.41 16,18.41 IC9.D1 | v18.04,18.34 18.23,18.53 18.48,18.53 18.54,18.47 18.61,18.53 R4.2
  Bottom 0.127: v15.56,18.22 17.91,18.22 v18.04,18.34
N$3  (via drill 0.3)
  Top 0.127: v15.69,17.58 16,17.9 IC9.E1 | v18.42,17.33 18.54,17.45 18.86,17.45 18.93,17.52 18.99,17.45 R2.2
  Bottom 0.127: v15.69,17.58 18.16,17.58 v18.42,17.33
N$4  (via drill 0.3)
  Top 0.127: v35.31,18.41 35.31,18.34 34.86,17.9 34.61,17.9 U1.P$N24 | v36.45,19.93 36.52,19.99 36.52,20.12 36.2,20.44 35.63,20.44 35.31,20.12 35.31,19.99 35.37,19.93 35.37,19.74 C9.1
  Bottom 0.127: v35.31,18.41 35.31,18.79 v36.45,19.93
N$5  (via drill 0.3)
  Top 0.127: v34.1,18.34 34.1,19.11 U1.P$H23 | v36.33,17.14 36.96,17.77 36.96,19.49 37.25,19.77 | 37.25,19.77 38.04,20.57 38.04,21.01 L1.1 | 37.25,19.77 36.52,20.5 36.52,20.76 36.58,20.82 36.58,21.01 C3.1
  Bottom 0.127: v34.1,18.34 35.31,17.14 v36.33,17.14
N$9
  Top 0.127: IC3.1 15.56,7.74 16.26,7.74 18.16,9.64 18.42,9.64 18.48,9.71 18.54,9.64 R3.2
N$10
  Top 0.127: U1.P$B3 28.77,20.95 28.7,21.01 28.7,21.33 28.01,22.03 28.01,22.66 27.88,22.79 L2.1
N$11
  Top 0.127: L2.2 27.88,23.87 27.88,24.88 L3.1
N$12  (via drill 0.3)
  Top 0.127: v34.61,21.45 34.8,21.26 34.8,21.2 34.61,21.01 34.61,20.95 U1.P$B24 | v37.98,23.61 38.17,23.8 38.17,24.25 38.36,24.44 X1.1 38.42,24.5 38.55,24.63 39.44,24.63 39.5,24.69 39.63,24.69 39.69,24.63 39.88,24.63 C1.2
  Bottom 0.127: v34.61,21.45 35.82,21.45 v37.98,23.61
N$13
  Top 0.127: U1.P$A18 32.58,21.45 32.58,21.71 32.39,21.9 31.31,21.9 31.05,22.15 30.93,22.15 30.67,22.41 30.67,22.53 C13.1
N$16  (via drill 0.3)
  Top 0.127: v34.23,21.9 34.29,21.84 34.29,21.77 34.17,21.65 34.17,21.52 34.1,21.45 U1.P$A23 | v36.45,25.46 36.64,25.65 36.96,25.65 37.21,25.9 X1.3 37.28,25.96 37.4,26.09 37.4,26.54 37.72,26.85 39.5,26.85 39.94,26.41 39.94,26.09 C2.2
  Bottom 0.127: v34.23,21.9 34.23,23.23 v36.45,25.46
N$17
  Top 0.127: L5.1 29.09,30.73 29.21,30.6 29.21,25.96 29.4,25.77 29.85,25.77 C2-EP-DR.2 29.91,25.77 30.93,25.77 31.05,25.9 33.91,25.9 34.42,25.39 34.99,25.39 35.25,25.14 D5.2 35.31,25.14 35.69,25.52 35.69,27.61 40.96,32.88 Q3.3
N$18
  Top 0.127: J1.4 10.86,21.84 11.43,21.84 12.13,22.53 12.13,25.27 12.45,25.58 13.46,25.58 13.78,25.27 13.78,24.82 13.85,24.76 EPD_C2.2
N$19
  Top 0.127: J1.5 10.86,21.33 11.43,21.33 12.51,22.41 12.51,22.47 12.89,22.85 13.27,22.85 13.91,23.49 EPD_C1.2
N$21  (via drill 0.3)
  Top 0.127: v9.4,15.55 10.16,14.79 10.23,14.85 10.42,14.85 10.48,14.79 10.8,14.79 J1.18 | v15.12,22.09 14.42,21.39 14.1,21.39 13.97,21.26 EPD_C6.2
  Bottom 0.127: v9.4,15.55 9.59,15.74 9.59,15.8 11.62,17.84 11.75,17.84 12.83,18.91 12.83,22.03 13.85,23.04 14.48,23.04 15.12,22.41 v15.12,22.09
N$22  (via drill 0.3)
  Top 0.127: v9.66,14.66 9.97,14.34 10.8,14.34 J1.19 | v14.67,20.25 14.48,20.06 14.1,20.06 14.04,19.99 EPD_C7.2
  Bottom 0.127: v9.66,14.66 9.66,15.17 9.85,15.36 9.85,15.68 11.75,17.58 11.88,17.58 13.08,18.79 13.08,21.9 13.97,22.79 14.35,22.79 14.67,22.47 v14.67,20.25
N$23
  Top 0.127: R2_USB.1 16.2,32.82 16.2,32.38 17.4,31.17 20.32,31.17 21.4,30.09 21.4,29.07 J4.B5
N$24  (via drill 0.3)
  Top 0.127: v10.1,13.83 J1.20 | v13.53,19.23 13.78,19.23 13.97,19.04 13.97,18.6 14.04,18.53 EPD_C8.2
  Bottom 0.127: v10.1,13.83 10.1,15.55 11.88,17.33 12,17.33 13.53,18.85 v13.53,19.23
N$26
  Top 0.127: J1.22 10.86,12.82 11.43,12.82 12,13.39 12,14.85 12.64,15.49 13.34,15.49 13.85,15.99 13.97,15.99 EPD_C10.2
N$28
  Top 0.127: J1.24 10.86,11.8 12.64,11.8 13.97,13.14 13.97,13.64 EPD_C12.2
OUT+  (via drill 0.3)
  Top 0.127: v6.23,6.53 5.97,6.28 5.97,6.15 IC2.A3 | v7.81,4.95 8.19,5.33 8.26,5.33 8.83,5.9 TP_OP.TP
  Bottom 0.127: v7.81,4.95 v6.23,6.53
OUT-  (via drill 0.3)
  Top 0.127: v6.48,5.64 5.97,5.14 IC2.C3 | v10.29,5.07 11.24,6.02 TP_ON.TP
  Bottom 0.127: v6.48,5.64 7.62,4.5 9.72,4.5 v10.29,5.07
P0.0/XL1  (via drill 0.3)
  Top 0.127: v27.18,22.47 28.39,21.26 28.39,21.07 28.45,21.01 28.45,20.82 28.39,20.76 28.39,20.57 28.51,20.44 28.51,20.18 U1.P$D2 | v23.75,23.49 23.5,23.74 22.74,23.74 22.48,23.99 X2.1 22.42,24.06 22.23,24.25 20.51,24.25 20.45,24.19 20.32,24.19 C17.2
  Bottom 0.127: v27.18,22.47 26.04,22.47 25.02,23.49 v23.75,23.49
P0.0/XL2  (via drill 0.3)
  Top 0.127: v26.74,19.23 27.12,19.23 27.75,19.87 28.2,19.87 28.39,19.68 28.51,19.68 U1.P$F2 | v23.75,21.01 23.5,21.26 22.74,21.26 22.48,21.52 X2.2 22.42,21.58 22.23,21.58 21.78,22.03 21.78,22.66 21.53,22.92 21.09,22.92 20.26,22.09 20.26,21.84 C18.2
  Bottom 0.127: v26.74,19.23 25.53,19.23 v23.75,21.01
P0.13  (via drill 0.3)
  Top 0.127: C30.2 37.21,2.34 37.47,2.34 37.53,2.28 37.85,2.6 37.85,3.87 37.47,4.25 37.21,4.25 R5.1 37.21,4.31 37.21,4.63 36.77,5.07 32.83,5.07 v32.77,5.01 32.77,4.06 SW_UP.2 | v30.36,14.28 30.36,14.41 30.04,14.72 30.04,14.85 U1.P$AD8
  Bottom 0.127: v30.36,14.28 30.36,13.96 32.77,11.55 v32.77,5.01
P0.13/1.5D1
  Top 0.127: IC2.A2 5.46,6.15 5.46,6.47 5.34,6.6 1.78,6.6 1.53,6.34 1.53,4.18 1.84,3.87 1.91,3.93 2.16,3.93 C32.2
P0.14  (via drill 0.3)
  Top 0.127: v29.85,15.36 30.29,15.36 U1.P$AC9 | C31.2 26.8,3.87 26.74,3.93 26.8,3.99 26.8,4.18 v27.05,4.44 26.86,4.31 26.8,4.37 26.48,4.37 26.2,4.09 | 26.2,4.09 26.17,4.06 26.17,2.34 26.36,2.15 26.8,2.15 R8.1 | 26.2,4.09 25.34,4.95 22.23,4.95 21.78,4.5 21.78,3.93 SW_ENT.2
  Bottom 0.127: v29.85,15.36 29.85,14.85 29.91,14.79 29.91,14.03 32.52,11.42 32.52,10.66 27.05,5.2 v27.05,4.44
P1.01  (via drill 0.3)
  Top 0.127: v34.1,15.68 34.17,15.74 34.1,15.8 34.1,16.12 U1.P$Y23 | v37.53,17.52 v36.77,16.76 | v43.12,23.11 43.12,23.74 43.31,23.93 Q1.1 43.25,23.93 42.99,24.19 42.8,24.19 42.36,24.63 41.28,24.63 R_PWR_EPD.1
  Bottom 0.127: v34.1,15.68 34.36,15.68 35.37,16.69 36.71,16.69 v36.77,16.76 | v43.12,23.11 v37.53,17.52
P1.02  (via drill 0.3)
  Top 0.127: v35.5,14.79 35.5,15.93 35.25,16.18 34.99,16.18 34.8,16.38 34.61,16.38 U1.P$W24 | v11.5,3.29 10.8,3.99 SW_DN.2 | v13.97,5.14 13.85,5.26 13.78,5.2 13.72,5.2 13.66,5.26 13.06,5.26 C29.2
  Top 0.152: R7.1 14.79,5.14 v13.97,5.14
  Bottom 0.127: v35.5,14.79 35.5,7.1 32.45,4.06 27.69,4.06 27.12,3.48 13.97,3.48 | 13.97,3.48 11.69,3.48 v11.5,3.29 | 13.97,3.48 v13.97,5.14
PMIC_INT  (1 unrouted)
PREVGH  (via drill 0.3)
  Top 0.127: 12.29,16.34 12.58,16.63 13.34,16.63 13.97,17.26 EPD_C9.2 | 12.29,16.34 11.75,15.8 11.75,13.64 11.43,13.33 10.86,13.33 J1.21 | v30.04,25.07 30.36,25.07 30.42,25.14 D5.1 | v13.72,32 11.69,29.96 v11.69,29.84 | v11.56,18.28 11.56,17.07 12.29,16.34
  Bottom 0.127: v30.04,25.07 30.04,25.27 24.64,30.66 24.64,30.92 24.39,31.17 17.34,31.17 16.39,30.22 15.5,30.22 v13.72,32 | v11.69,29.84 11.69,18.41 v11.56,18.28
PREVGL  (via drill 0.3)
  Top 0.127: 11.53,12.41 12.26,13.14 12.26,13.83 12.7,14.28 13.34,14.28 13.97,14.91 EPD_C11.2 | 11.53,12.41 11.43,12.31 10.86,12.31 J1.23 | v37.72,28.88 38.67,28.88 D2.2 | v14.23,33.14 11.24,30.15 11.24,29.84 v10.35,28.95 | v11.56,12.37 11.53,12.41
  Bottom 0.127: v37.72,28.88 29.85,28.88 26.36,32.38 14.99,32.38 v14.23,33.14 | v10.35,28.95 10.35,23.23 8.45,21.33 8.45,14.09 10.16,12.37 v11.56,12.37
RESET  (via drill 0.3)
  Top 0.127: R1_EP_DR.2 42.93,31.04 v42.42,31.04 41.98,31.04 41.79,30.85 Q3.2 | v42.17,9.64 42.1,9.71 42.1,9.77 41.98,9.9 41.91,9.9 41.66,10.15 41.4,10.15 41.02,10.53 40.9,10.53 J2.6 | v10.1,22.34 10.8,22.34 J1.3 | v24.2,13.71 24.39,13.52 24.58,13.52 25.02,13.07 25.47,13.07 TP_RESET.TP | v37.15,6.28 36.2,5.33 34.42,5.33 34.23,5.52 34.17,5.52 34.1,5.45 33.53,5.45 33.4,5.33 33.09,5.33 29.47,8.95 26.93,8.95 25.91,9.96 25.91,12.06 25.53,12.44 25.53,13.01 TP_RESET.TP | TP_RESET.TP 27.82,15.41 U1.P$AC13
  Bottom 0.127: v42.42,31.04 44.52,28.95 44.52,10.85 43.31,9.64 v42.17,9.64 42.17,9.07 39.37,6.28 v37.15,6.28 | v10.1,22.34 10.1,18.09 8.96,16.95 8.96,14.34 9.91,13.39 15.31,13.39 19.82,17.9 20.45,17.9 24.2,14.15 v24.2,13.71
RF
  Top 0.127: L1.2 39.12,21.07 40.07,21.07 C4.1 40.07,21.01 40.07,20.82 40.01,20.76 40.01,20.5 40.2,20.31 41.21,20.31 41.44,20.53 | 41.44,20.53 42.42,19.55 43.88,19.55 44.26,19.17 ANT1.1 | 41.44,20.53 41.4,20.57 41.4,20.82 41.47,20.88 41.47,21.07 C22.1
SCK  (via drill 0.3)
  Top 0.127: v29.09,24.12 30.17,23.04 30.17,22.79 30.29,22.66 30.29,22.22 30.61,21.9 30.86,21.9 31.05,21.71 31.05,21.45 U1.P$A12 | v23.31,31.62 v24.2,30.73 | v13.34,32.88 13.34,32.63 10.8,30.09 v10.8,30.03 | v10.1,17.45 10.23,17.33 J1.13
  Bottom 0.127: v29.09,24.12 29.09,25.84 v24.2,30.73 | v23.31,31.62 15.12,31.62 13.85,32.88 v13.34,32.88 | v10.8,30.03 10.8,18.15 v10.1,17.45
SCL  (via drill 0.3)  (1 unrouted)
  Top 0.127: 17.08,12.18 17.08,13.01 TP_SCL.TP 17.08,12.18 | 17.08,12.18 17.08,11.87 17.02,11.8 17.02,11.68 17.08,11.61 17.08,11.49 17.02,11.42 17.02,11.29 R17.2 | v19.31,19.11 19.31,18.98 19.18,18.85 19.18,18.79 19.05,18.66 19.05,18.6 19.12,18.53 R4.1 | v4.45,5.14 4.58,5.01 4.77,5.01 4.83,5.07 4.96,5.07 IC2.C1 | v15.05,7.17 15.05,7.68 IC3.12 | v31.82,9.33 31.44,9.71 31.5,9.77 31.5,9.9 31.37,10.03 31.37,10.09 30.93,10.53 30.67,10.53 U3.7 | 17.08,12.18 16.83,12.18 16.51,11.87 v16.51,11.8
  Bottom 0.127: 7.56,29.71 9.85,29.71 10.61,30.47 11.69,30.47 19.31,22.85 v19.31,19.11 | 7.56,29.71 7.5,29.71 6.23,30.98 6.23,32.06 7.24,33.08 8.32,33.08 8.58,32.82 IC1.B1 | v4.45,5.14 4.45,7.42 7.53,10.5 | 7.53,10.5 7.56,10.53 7.56,29.71 | v15.05,7.17 10.86,7.17 7.53,10.5 | v31.82,9.33 31.82,8.56 27.24,3.99 18.23,3.99 v15.05,7.17 | v16.51,11.8 16.51,10.91 15.12,9.52 15.12,7.17 v15.05,7.17
SDA  (via drill 0.3)  (1 unrouted)
  Top 0.127: v16.13,8.25 15.56,8.25 IC3.2 | v17.53,10.91 17.53,10.66 17.4,10.53 17.15,10.53 R18.2 | v26.67,10.22 28.13,11.68 30.23,11.68 30.61,11.29 30.61,11.1 U3.8 | v26.74,18.47 27.69,18.47 27.75,18.41 28.01,18.41 U1.P$L1 | v24.39,19.42 22.74,17.77 22.67,17.77 22.29,17.39 21.72,17.39 TP_SDA.TP 21.66,17.33 20.51,17.33 20.39,17.45 v20.26,17.45 19.5,17.45 R2.1
  Bottom 0.127: v16.13,8.25 16.13,9.26 17.5,10.63 | 17.5,10.63 17.53,10.66 v17.53,10.91 | 20.26,10.22 17.91,10.22 17.5,10.63 | 20.26,10.22 v26.67,10.22 | v26.74,18.47 25.34,18.47 v24.39,19.42 23.31,20.5 23.31,23.68 25.97,26.34 25.97,28.31 23.37,30.92 18.54,30.92 17.59,29.96 15.12,29.96 11.81,33.27 9.46,33.27 9.02,32.82 9.02,32.76 IC1.C1 | v20.26,17.45 20.26,10.22
SWDCLK  (via drill 0.3)
  Top 0.127: v35.05,15.74 34.86,15.93 34.61,15.93 U1.P$AA24 | v36.39,16.25 37.02,16.25 38.36,17.58 38.36,18.47 | 38.36,18.47 38.36,18.72 TP_SWDCLK.TP 38.36,18.47 | 38.36,18.47 39.25,18.47 40.39,17.33 42.17,17.33 44.39,15.1 44.39,13.71 43.44,12.76 42.42,12.76 42.36,12.82 42.1,12.82 41.91,12.63 41.66,12.63 40.9,11.87 J2.4
  Bottom 0.127: v35.05,15.74 35.88,15.74 v36.39,16.25
SWDIO  (via drill 0.3)
  Top 0.127: v34.99,15.1 34.8,15.3 34.67,15.3 34.61,15.36 U1.P$AC24 | v35.05,13.77 35.94,13.77 v36.39,13.33 | v41.6,13.07 41.53,13.14 40.9,13.14 J2.2 | v42.1,17.77 41.15,18.72 TP_SWDIO.TP
  Bottom 0.127: v34.99,15.1 34.99,13.83 v35.05,13.77 | v36.39,13.33 36.58,13.33 37.02,12.88 41.21,12.88 | 41.21,12.88 41.4,12.88 v41.6,13.07 | v42.1,17.77 42.1,15.87 41.21,14.98 41.21,12.88
SWO
  Top 0.127: U1.P$AD22 33.53,14.85 33.53,14.66 33.4,14.53 33.4,13.77 33.47,13.71 33.47,12.5 TP_SWO.TP
VBAT  (via drill 0.3)  (1 unrouted)
  Top 0.3: U3.3 28.7,10.09 28.7,10.53 U3.2 28.51,10.53 28.39,10.53 28.32,10.6 28.07,10.6 v27.88,10.79 | v10.23,30.73 9.85,30.35 C37.2 | C27.2 v31.63,11.04 31.75,11.1 31.82,11.17 32.58,11.17 33.85,9.9 33.85,9.2 TP_VBAT.TP
  Bottom 0.3: v10.23,30.73 10.35,30.73 10.48,30.85 11.81,30.85 29.88,12.79 | v31.63,11.04 29.88,12.79 | 29.88,12.79 v27.88,10.79
VBUS  (via drill 0.3)  (1 unrouted)
  Top 0.3: C38.2 6.54,29.96 6.48,29.96 6.42,29.9 6.29,29.9 6.1,30.09 5.4,30.09 3.94,28.63 3.94,28.5 4,28.44 4,27.93 3.94,27.87 3.94,27.49 4.19,27.23 4.96,27.23 D3.5 5.08,27.23 11.75,27.23 14.67,30.15 15.05,30.15 | 28.2,14.53 28.51,14.85 U1.P$AD2 | 28.2,14.53 28.2,14.03 28.9,13.33 28.9,12.88 C21.1 | 15.05,30.15 15.05,30.47 15.21,30.63 | 15.05,30.15 15.05,29.65 C42.1 | 15.21,30.63 15.31,30.73 15.31,31.17 C43.2 | 20.83,28.12 20.83,29.01 J4.A9_B4 | 20.83,28.12 20.64,27.93 17.91,27.93 15.21,30.63 | v25.53,28.12 25.53,29.01 J4.A4_B9 | v20.96,28.12 20.83,28.12 | v26.67,14.53 28.2,14.53 | v21.47,19.3 21.47,20.5 21.09,20.88 21.09,22.22 v21.34,22.47
  Bottom 0.3: v20.96,28.12 21.34,28.12 | 21.34,28.12 v25.53,28.12 | v26.67,14.53 26.23,14.53 v21.47,19.3 | 21.34,28.12 v21.34,22.47
VBUS/2.6D1
  Top 0.127: U1.P$AC5 29.28,15.36 29.02,15.36 28.9,15.23 28.83,15.3 28.77,15.23 28.7,15.23 28.58,15.36 28.39,15.36 28.01,14.98 26.17,14.98 25.78,14.6 24.7,14.6 24.39,14.91 24.39,15.36 24.32,15.42 C20.1
VREG  (via drill 0.3)
  Top 0.3: v6.67,31.87 6.61,31.93 5.97,31.93 C39.1 | 16.07,19.55 16.39,19.55 IC9.A2 16.58,19.55 IC9.A3 | 16.07,19.55 IC9.A1 | 16.61,26.5 16.64,26.47 16.64,25.27 16.26,24.88 15.75,24.88 C24.2 15.75,24.76 15.75,24.5 15.62,24.38 15.62,20.06 15.66,20.03 | 16.61,26.5 16.45,26.66 16.45,26.92 16.32,27.04 C23.2 | 15.66,20.03 16,19.68 16.07,19.55 | 16.61,26.5 v16.96,26.85 | 15.66,20.03 14.93,19.3 14.93,13.39 15.18,13.14 15.18,11.93 TP_VREG.TP
  Bottom 0.3: 8.58,32.19 8.58,32.31 IC1.B2 | 8.58,32.19 8.26,31.87 v6.67,31.87 | v16.96,26.85 12.19,31.62 9.08,31.62 8.64,32.06 8.58,32.19